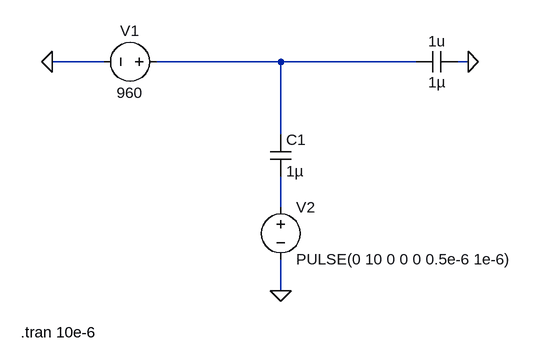
[diagram p0: schematic einkopplung_kapazitiv.asc]
einkopplung_kapazitiv.asc, the LTspice schematic file:
Version 4
SHEET 1 880 680
WIRE -64 48 -144 48
WIRE 208 48 16 48
WIRE 416 48 208 48
WIRE 496 48 480 48
WIRE 208 160 208 48
WIRE 208 272 208 224
WIRE 208 400 208 352
FLAG -144 48 0
FLAG 208 400 0
FLAG 496 48 0
SYMBOL cap 192 160 R0
SYMATTR InstName C1
SYMATTR Value 1µ
SYMBOL voltage 32 48 R90
WINDOW 0 -32 56 VBottom 2
WINDOW 3 32 56 VTop 2
SYMATTR InstName V1
SYMATTR Value 960
SYMBOL voltage 208 256 R0
WINDOW 123 0 0 Left 2
WINDOW 39 0 0 Left 2
SYMATTR InstName V2
SYMATTR Value PULSE(0 10 0 0 0 0.5e-6 1e-6)
SYMBOL cap 480 32 R90
WINDOW 0 0 32 VBottom 2
WINDOW 3 32 32 VTop 2
SYMATTR InstName 1u
SYMATTR Value 1µ
TEXT -192 464 Left 2 !.tran 10e-6

The netlist it stands for:
* einkopplung_kapazitiv.asc
C1 N001 N002 1µ
V1 N001 0 960
V2 N002 0 PULSE(0 10 0 0 0 0.5e-6 1e-6)
C§1u 0 N001 1µ
.tran 10e-6
.backanno
.end